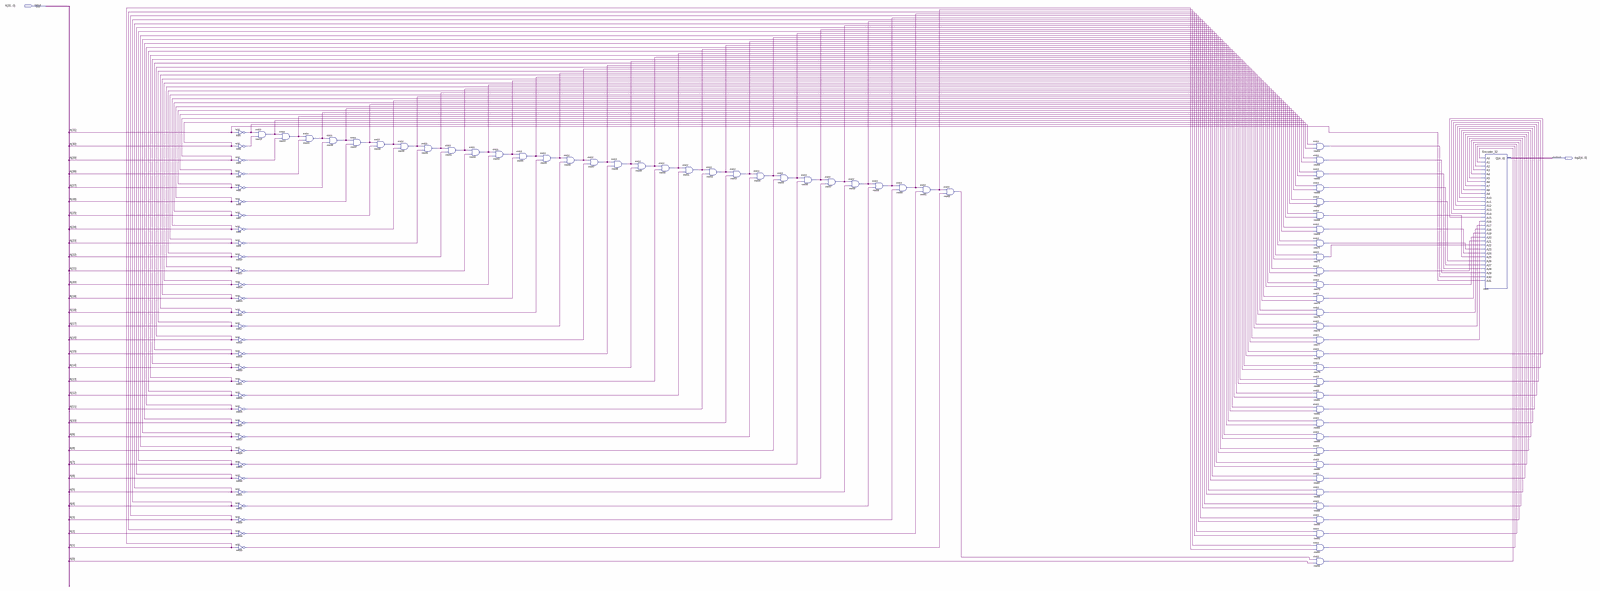
[diagram p0: schematic sheet, whole]
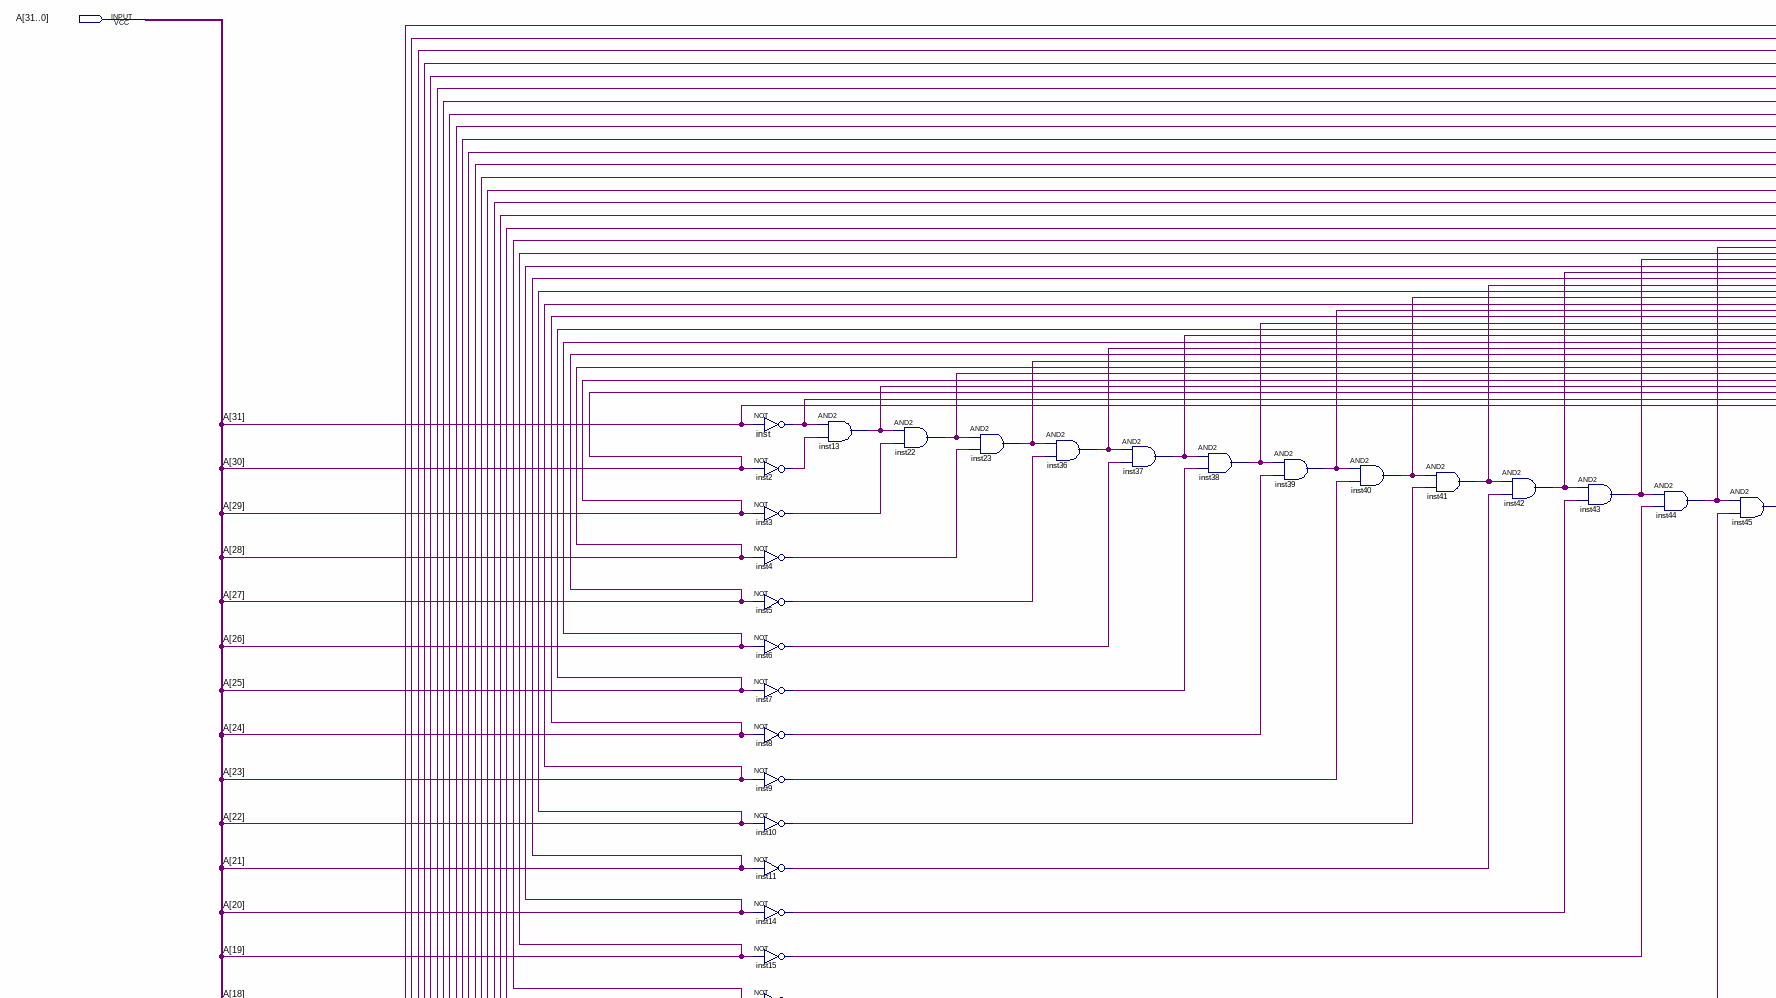
[diagram p1: schematic sheet, upper left part]
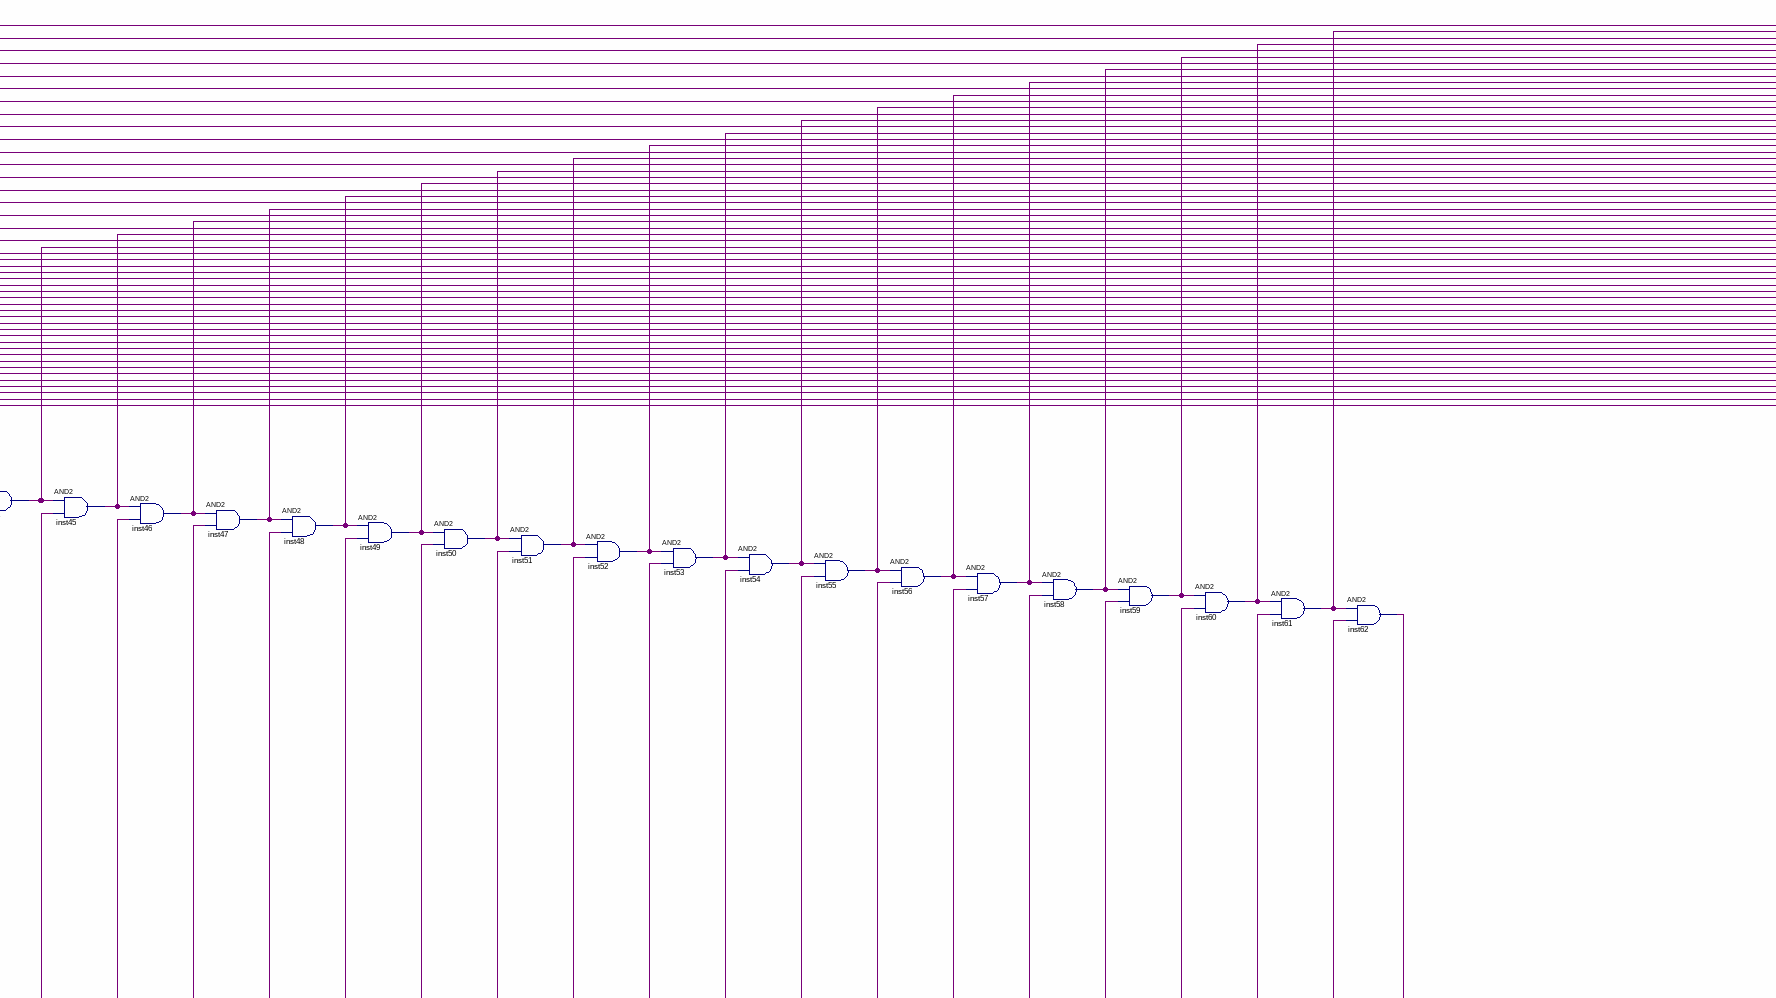
[diagram p2: schematic sheet, upper centre part]
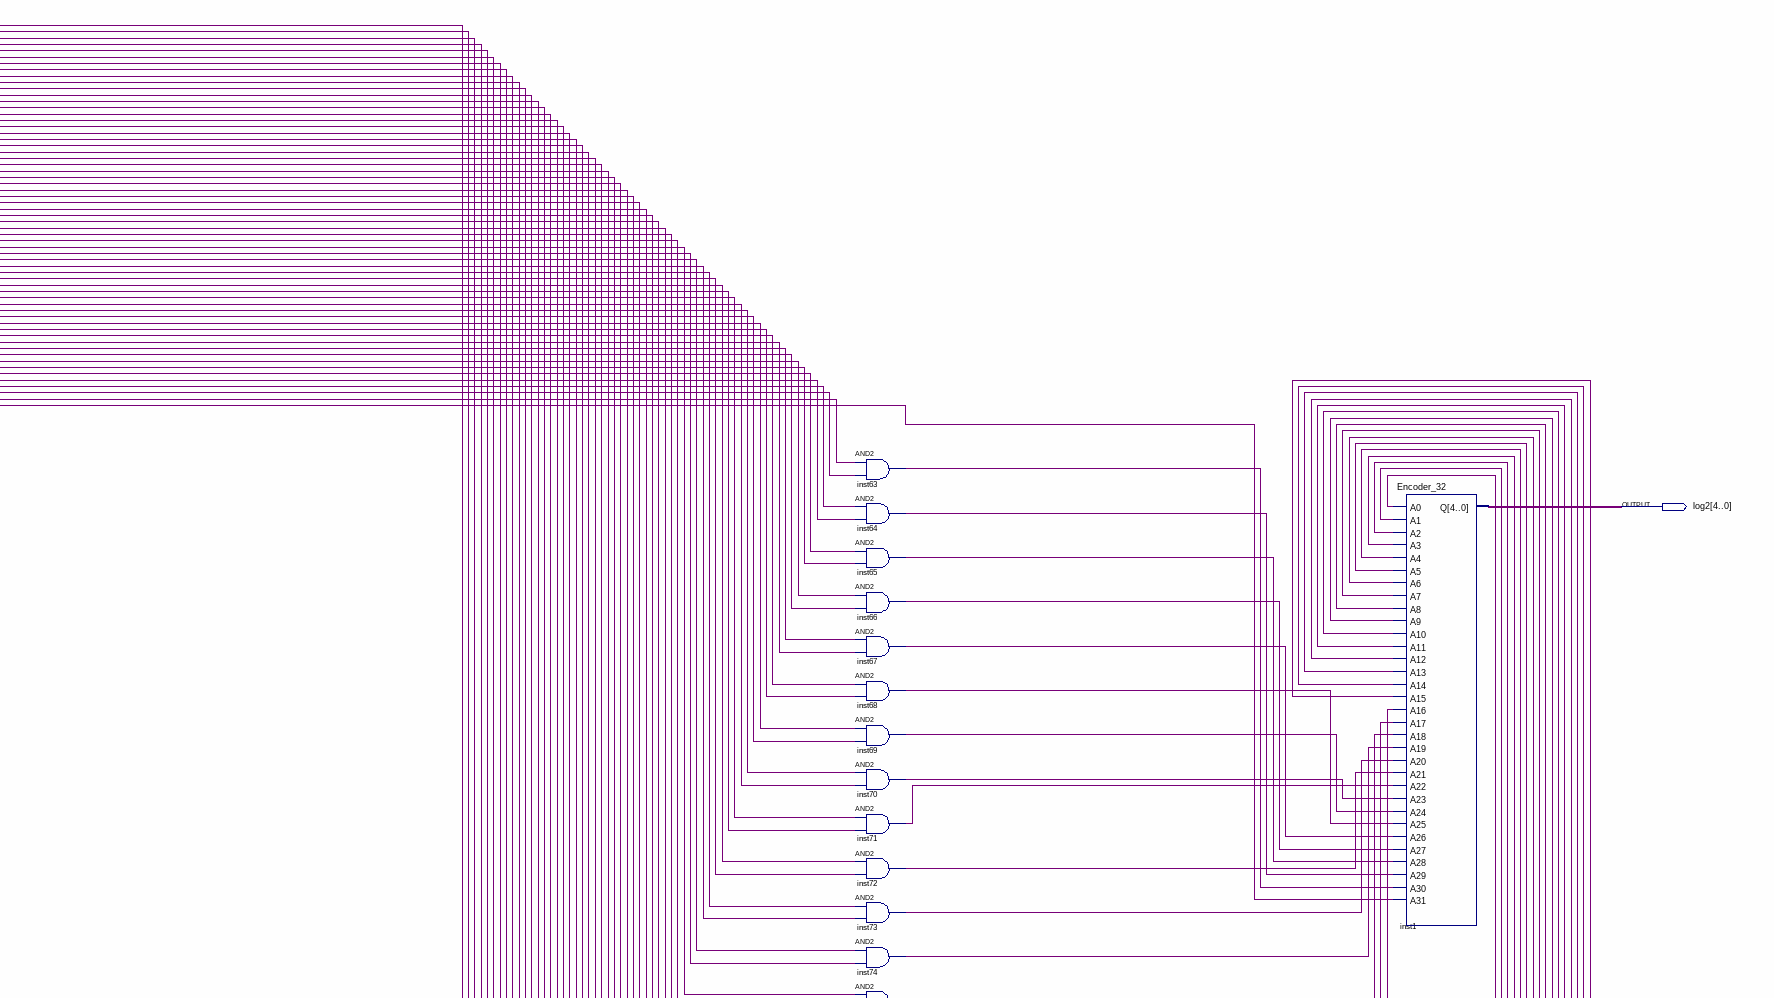
[diagram p3: schematic sheet, upper right part]
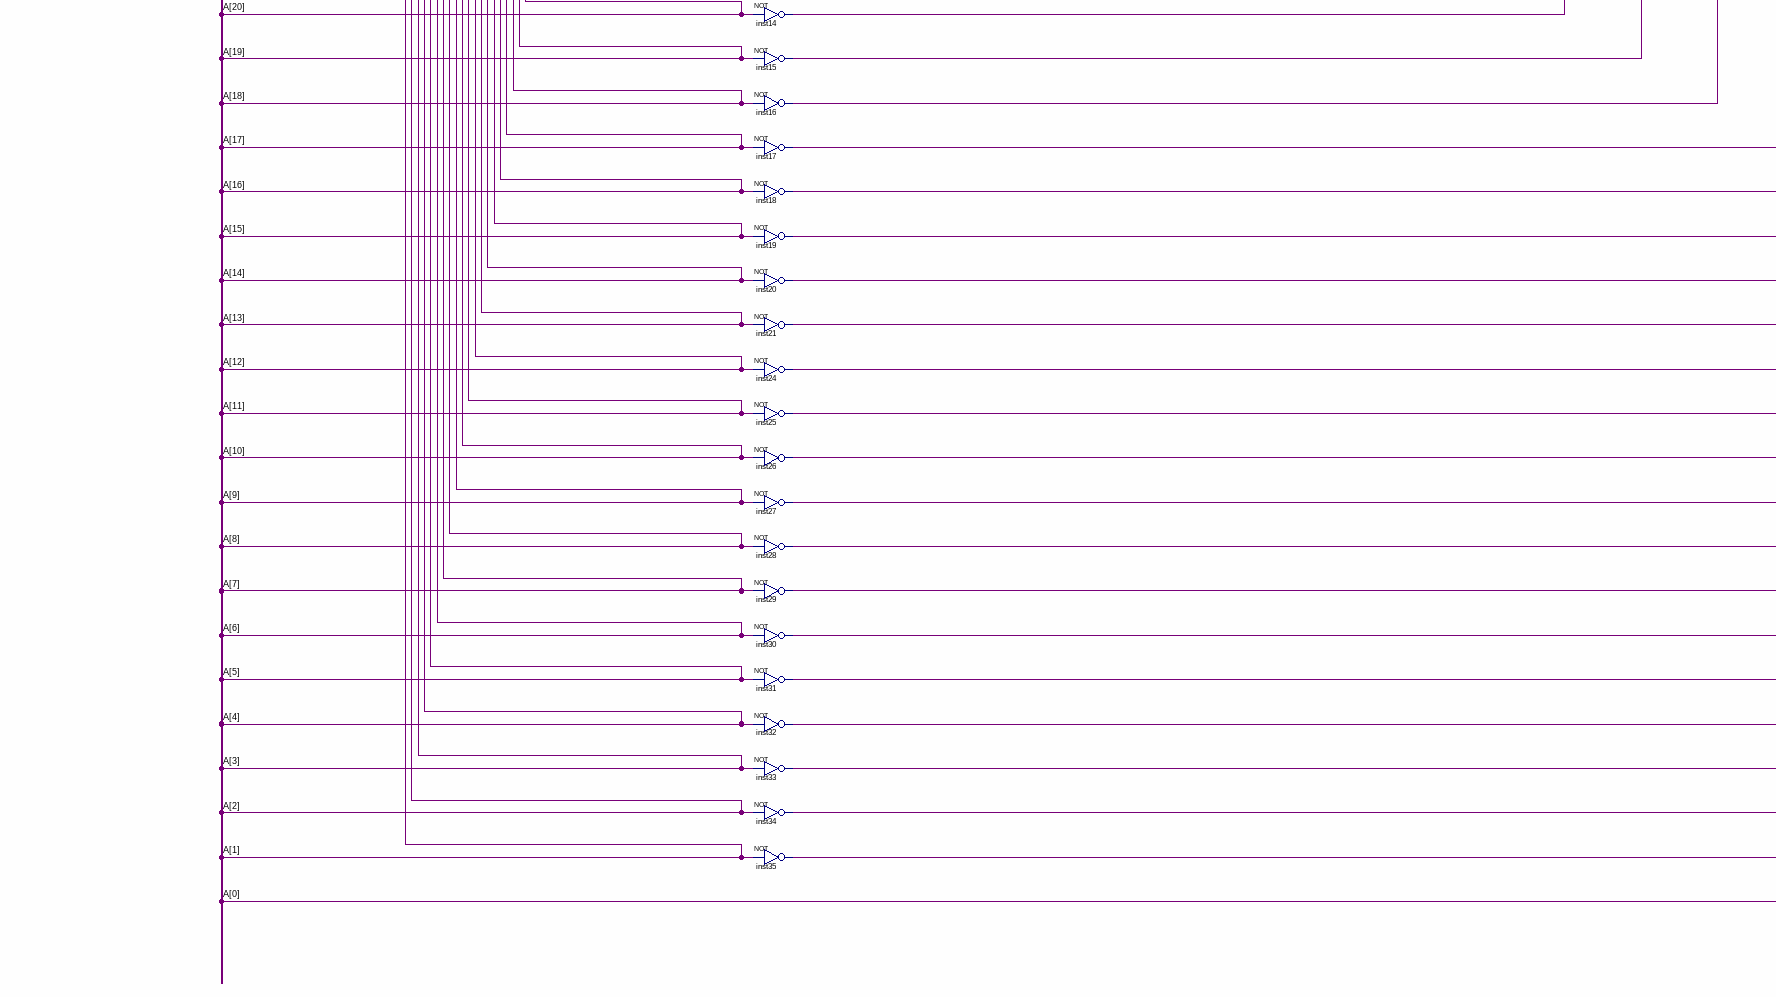
[diagram p4: schematic sheet, lower left part]
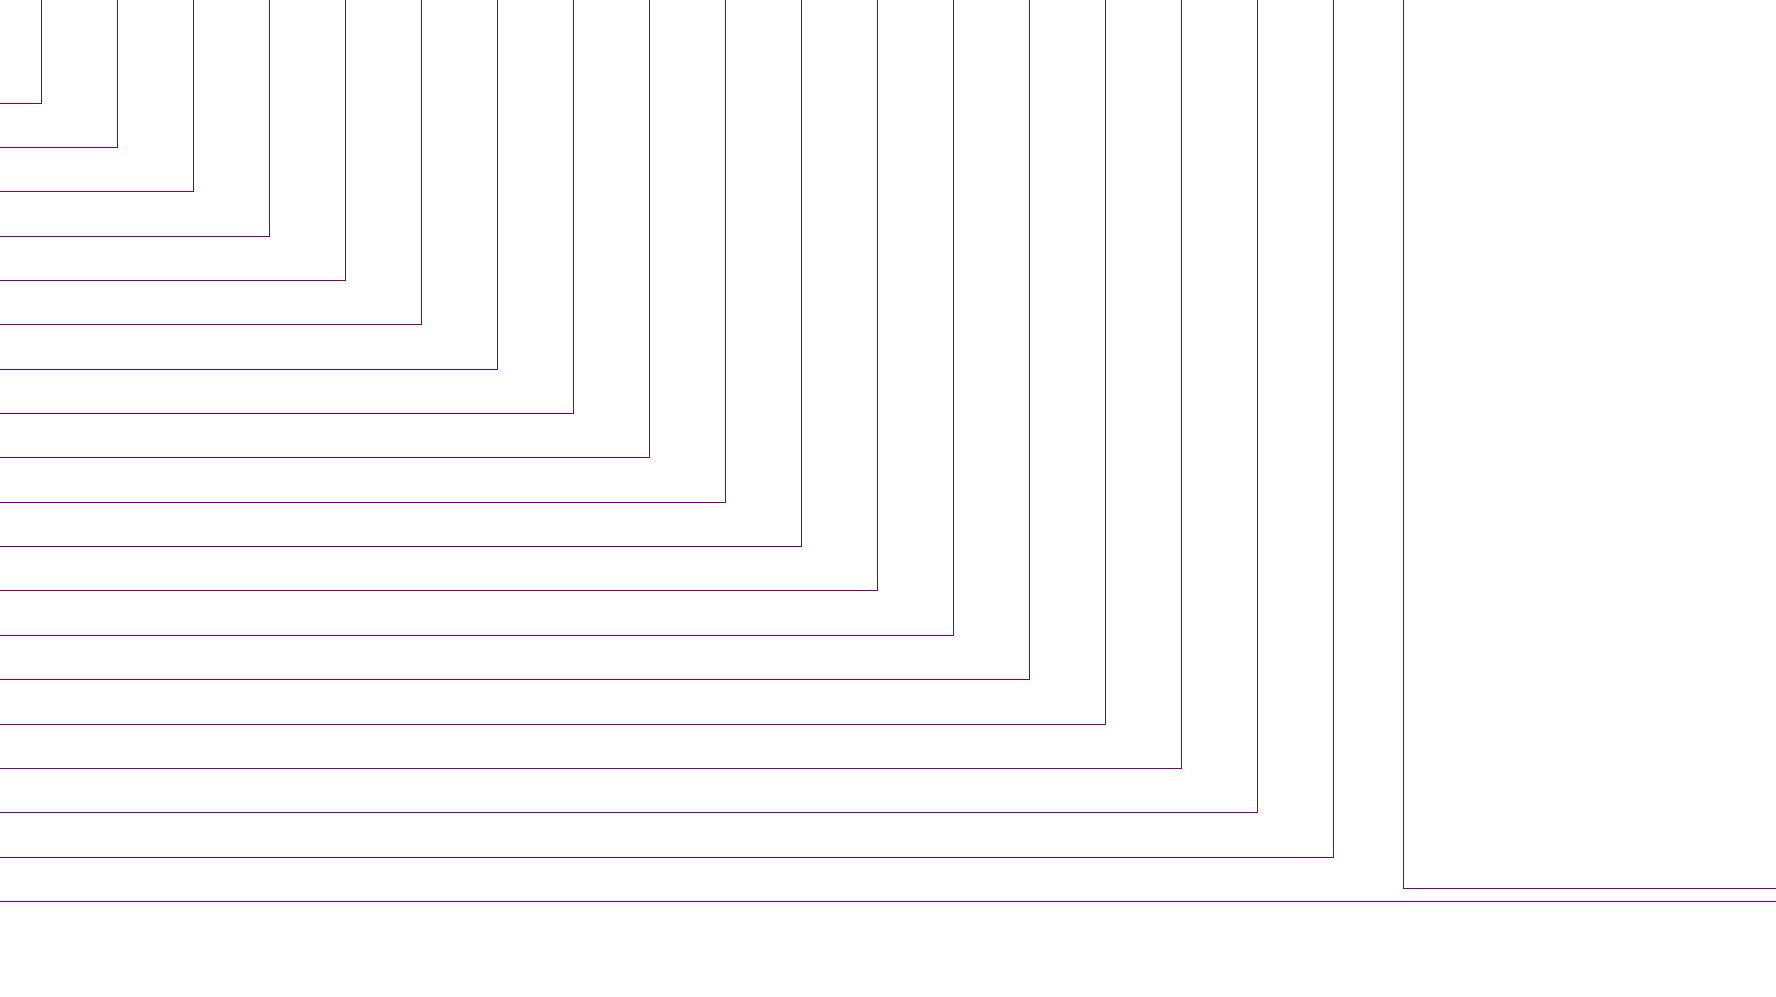
[diagram p5: schematic sheet, lower centre part]
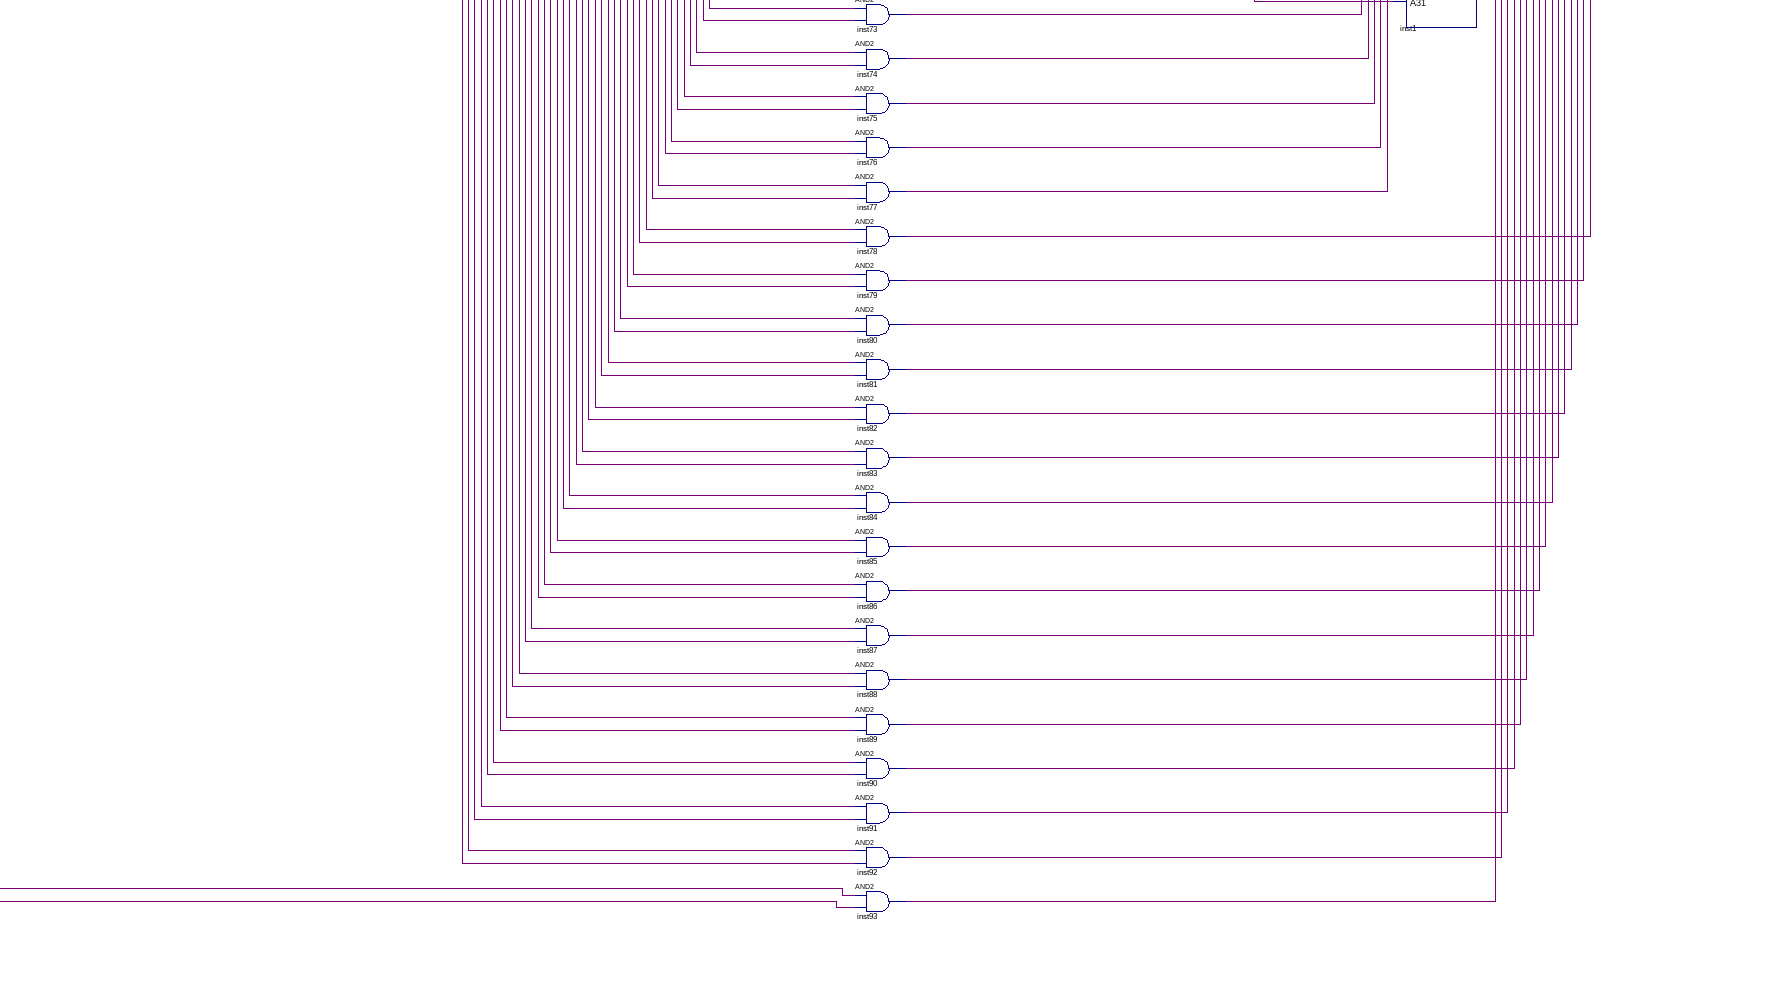
[diagram p6: schematic sheet, lower right part]
// Quartus schematic Log2_32.bdf as structural Verilog: 93 symbols, 2 pins
module Log2_32 (
  input  [31:0] A,
  output [4:0] log2
);

  wire inst2_out, inst3_out, inst4_out, inst5_out, inst6_out, inst7_out, inst8_out, inst9_out, inst10_out,
       inst11_out, inst13_out, inst14_out, inst15_out, inst16_out, inst17_out, inst18_out, inst19_out,
       inst20_out, inst21_out, inst22_out, inst23_out, inst24_out, inst25_out, inst26_out, inst27_out,
       inst28_out, inst29_out, inst30_out, inst31_out, inst32_out, inst33_out, inst34_out, inst35_out,
       inst36_out, inst37_out, inst38_out, inst39_out, inst40_out, inst41_out, inst42_out, inst43_out,
       inst44_out, inst45_out, inst46_out, inst47_out, inst48_out, inst49_out, inst50_out, inst51_out,
       inst52_out, inst53_out, inst54_out, inst55_out, inst56_out, inst57_out, inst58_out, inst59_out,
       inst60_out, inst61_out, inst62_out, inst63_out, inst64_out, inst65_out, inst66_out, inst67_out,
       inst68_out, inst69_out, inst70_out, inst71_out, inst72_out, inst73_out, inst74_out, inst75_out,
       inst76_out, inst77_out, inst78_out, inst79_out, inst80_out, inst81_out, inst82_out, inst83_out,
       inst84_out, inst85_out, inst86_out, inst87_out, inst88_out, inst89_out, inst90_out, inst91_out,
       inst92_out, inst93_out, inst_out;

  not inst (inst_out, A[31]);
  not inst2 (inst2_out, A[30]);
  not inst3 (inst3_out, A[29]);
  not inst4 (inst4_out, A[28]);
  not inst5 (inst5_out, A[27]);
  not inst6 (inst6_out, A[26]);
  not inst7 (inst7_out, A[25]);
  not inst8 (inst8_out, A[24]);
  not inst9 (inst9_out, A[23]);
  not inst10 (inst10_out, A[22]);
  not inst11 (inst11_out, A[21]);
  not inst14 (inst14_out, A[20]);
  not inst15 (inst15_out, A[19]);
  not inst16 (inst16_out, A[18]);
  not inst17 (inst17_out, A[17]);
  not inst18 (inst18_out, A[16]);
  not inst19 (inst19_out, A[15]);
  not inst20 (inst20_out, A[14]);
  not inst21 (inst21_out, A[13]);
  not inst24 (inst24_out, A[12]);
  not inst25 (inst25_out, A[11]);
  not inst26 (inst26_out, A[10]);
  not inst27 (inst27_out, A[9]);
  not inst28 (inst28_out, A[8]);
  not inst29 (inst29_out, A[7]);
  not inst30 (inst30_out, A[6]);
  not inst31 (inst31_out, A[5]);
  not inst32 (inst32_out, A[4]);
  not inst33 (inst33_out, A[3]);
  not inst34 (inst34_out, A[2]);
  not inst35 (inst35_out, A[1]);
  and inst13 (inst13_out, inst_out, inst2_out);
  and inst22 (inst22_out, inst13_out, inst3_out);
  and inst23 (inst23_out, inst22_out, inst4_out);
  and inst36 (inst36_out, inst23_out, inst5_out);
  and inst37 (inst37_out, inst36_out, inst6_out);
  and inst38 (inst38_out, inst37_out, inst7_out);
  and inst39 (inst39_out, inst38_out, inst8_out);
  and inst40 (inst40_out, inst39_out, inst9_out);
  and inst41 (inst41_out, inst40_out, inst10_out);
  and inst42 (inst42_out, inst41_out, inst11_out);
  and inst43 (inst43_out, inst42_out, inst14_out);
  and inst44 (inst44_out, inst43_out, inst15_out);
  and inst45 (inst45_out, inst44_out, inst16_out);
  and inst46 (inst46_out, inst45_out, inst17_out);
  and inst47 (inst47_out, inst46_out, inst18_out);
  and inst48 (inst48_out, inst47_out, inst19_out);
  and inst49 (inst49_out, inst48_out, inst20_out);
  and inst50 (inst50_out, inst49_out, inst21_out);
  and inst51 (inst51_out, inst50_out, inst24_out);
  and inst52 (inst52_out, inst51_out, inst25_out);
  and inst53 (inst53_out, inst52_out, inst26_out);
  and inst54 (inst54_out, inst53_out, inst27_out);
  and inst55 (inst55_out, inst54_out, inst28_out);
  and inst56 (inst56_out, inst55_out, inst29_out);
  and inst57 (inst57_out, inst56_out, inst30_out);
  and inst58 (inst58_out, inst57_out, inst31_out);
  and inst59 (inst59_out, inst58_out, inst32_out);
  and inst60 (inst60_out, inst59_out, inst33_out);
  and inst61 (inst61_out, inst60_out, inst34_out);
  and inst62 (inst62_out, inst61_out, inst35_out);
  and inst63 (inst63_out, inst_out, A[30]);
  and inst64 (inst64_out, inst13_out, A[29]);
  and inst65 (inst65_out, inst22_out, A[28]);
  and inst66 (inst66_out, inst23_out, A[27]);
  and inst67 (inst67_out, inst36_out, A[26]);
  and inst68 (inst68_out, inst37_out, A[25]);
  and inst69 (inst69_out, inst38_out, A[24]);
  and inst70 (inst70_out, inst39_out, A[23]);
  and inst71 (inst71_out, inst40_out, A[22]);
  and inst72 (inst72_out, inst41_out, A[21]);
  and inst73 (inst73_out, inst42_out, A[20]);
  and inst74 (inst74_out, inst43_out, A[19]);
  and inst75 (inst75_out, inst44_out, A[18]);
  and inst76 (inst76_out, inst45_out, A[17]);
  and inst77 (inst77_out, inst46_out, A[16]);
  and inst78 (inst78_out, inst47_out, A[15]);
  and inst79 (inst79_out, inst48_out, A[14]);
  and inst80 (inst80_out, inst49_out, A[13]);
  and inst81 (inst81_out, inst50_out, A[12]);
  and inst82 (inst82_out, inst51_out, A[11]);
  and inst83 (inst83_out, inst52_out, A[10]);
  and inst84 (inst84_out, inst53_out, A[9]);
  and inst85 (inst85_out, inst54_out, A[8]);
  and inst86 (inst86_out, inst55_out, A[7]);
  and inst87 (inst87_out, inst56_out, A[6]);
  and inst88 (inst88_out, inst57_out, A[5]);
  and inst89 (inst89_out, inst58_out, A[4]);
  and inst90 (inst90_out, inst59_out, A[3]);
  and inst91 (inst91_out, inst60_out, A[2]);
  and inst92 (inst92_out, inst61_out, A[1]);
  and inst93 (inst93_out, inst62_out, A[0]);
  Encoder_32 inst1 (
    .A0(inst93_out), .A1(inst92_out), .A2(inst91_out), .A3(inst90_out), .A4(inst89_out), .A5(inst88_out),
    .A6(inst87_out), .A7(inst86_out), .A8(inst85_out), .A9(inst84_out), .A10(inst83_out), .A11(inst82_out),
    .A12(inst81_out), .A13(inst80_out), .A14(inst79_out), .A15(inst78_out), .A16(inst77_out),
    .A17(inst76_out), .A18(inst75_out), .A19(inst74_out), .A20(inst73_out), .A21(inst72_out),
    .A22(inst71_out), .A23(inst70_out), .A24(inst69_out), .A25(inst68_out), .A26(inst67_out),
    .A27(inst66_out), .A28(inst65_out), .A29(inst64_out), .A30(inst63_out), .A31(A[31]), .Q(log2));
endmodule
